# EAGLE design Layer 4 (EAGLE 9.6.2)

## Sheet 1 of 3: Light Sensor
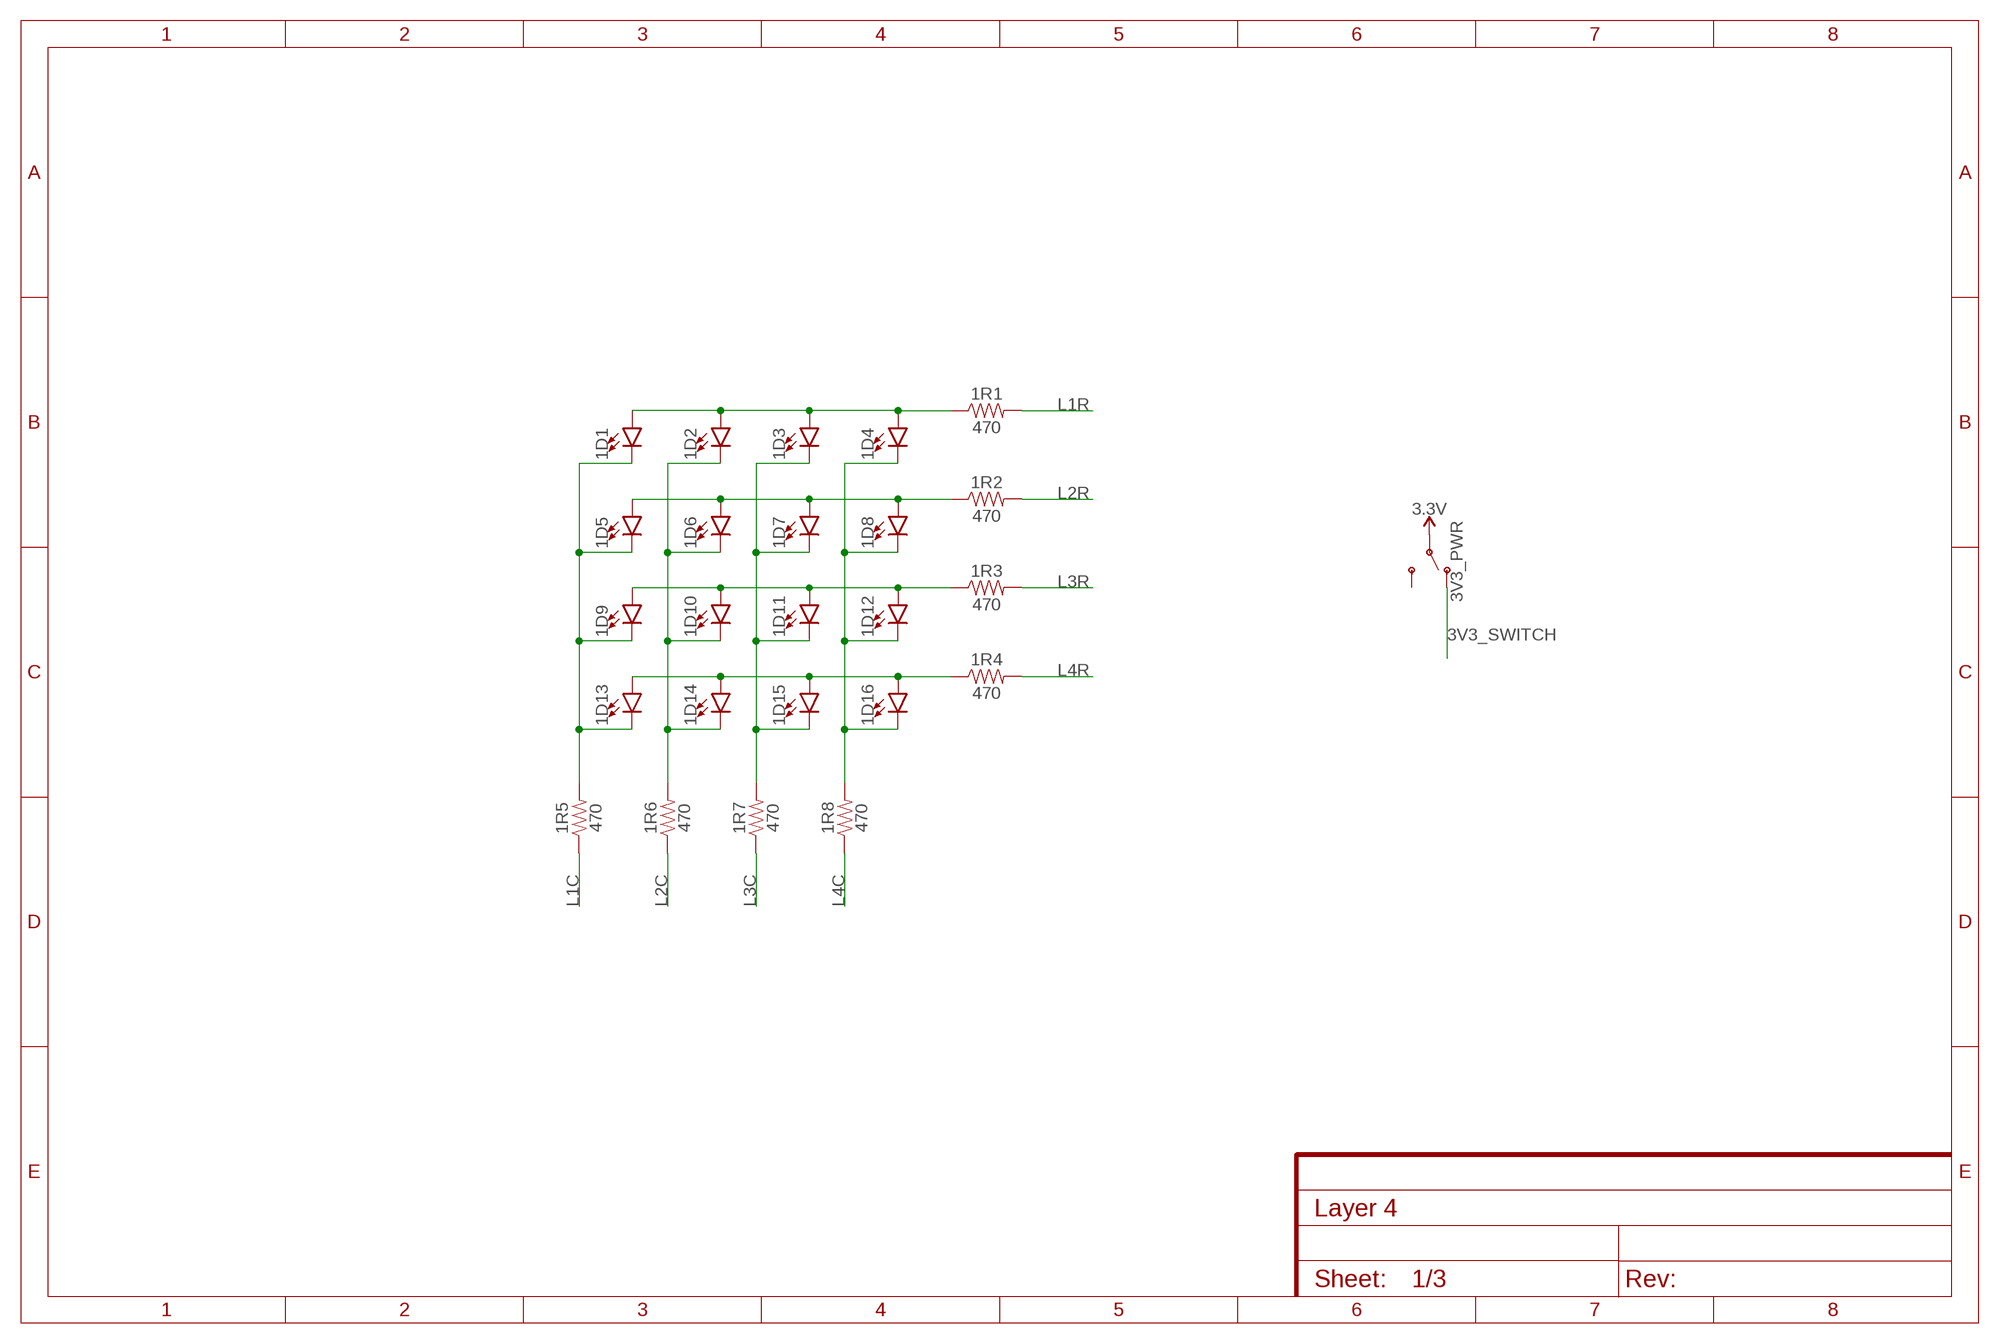
[diagram p0: schematic, sheet 1]

### Parts
1D1  LED0603  [LED-0603]
1D2  LED0603  [LED-0603]
1D3  LED0603  [LED-0603]
1D4  LED0603  [LED-0603]
1D5  LED0603  [LED-0603]
1D6  LED0603  [LED-0603]
1D7  LED0603  [LED-0603]
1D8  LED0603  [LED-0603]
1D9  LED0603  [LED-0603]
1D10  LED0603  [LED-0603]
1D11  LED0603  [LED-0603]
1D12  LED0603  [LED-0603]
1D13  LED0603  [LED-0603]
1D14  LED0603  [LED-0603]
1D15  LED0603  [LED-0603]
1D16  LED0603  [LED-0603]
1R1  470  RESISTOR0603  [R0603]
1R2  470  RESISTOR0603  [R0603]
1R3  470  RESISTOR0603  [R0603]
1R4  470  RESISTOR0603  [R0603]
1R5  470  RESISTOR0603  [R0603]
1R6  470  RESISTOR0603  [R0603]
1R7  470  RESISTOR0603  [R0603]
1R8  470  RESISTOR0603  [R0603]
3V3_PWR  SWITCH-SPDT-PTH-11.6X4.0MM-LOCK  [SWITCH_SPDT_PTH_11.6X4.0MM_LOCK]

### Nets
3.3V: 3V3_PWR.2(P) ; also sheet 2
3V3_SWITCH: 3V3_PWR.1(O) ; also sheet 2,3
L1C: 1R5.1 ; also sheet 2
L1R: 1R1.2 ; also sheet 2
L2C: 1R6.1 ; also sheet 2
L2R: 1R2.2 ; also sheet 2
L3C: 1R7.1 ; also sheet 2
L3R: 1R3.2 ; also sheet 2
L4C: 1R8.1 ; also sheet 2
L4R: 1R4.2 ; also sheet 2
N$9: 1D1.A 1D2.A 1D3.A 1D4.A 1R1.1
N$11: 1D1.C 1D5.C 1D9.C 1D13.C 1R5.2
N$19: 1D5.A 1D6.A 1D7.A 1D8.A 1R2.1
N$20: 1D9.A 1D10.A 1D11.A 1D12.A 1R3.1
N$21: 1D13.A 1D14.A 1D15.A 1D16.A 1R4.1
N$22: 1D2.C 1D6.C 1D10.C 1D14.C 1R6.2
N$23: 1D3.C 1D7.C 1D11.C 1D15.C 1R7.2
N$24: 1D4.C 1D8.C 1D12.C 1D16.C 1R8.2
Unconnected: 3V3_PWR.3(S)

## Sheet 2 of 3: STEM32
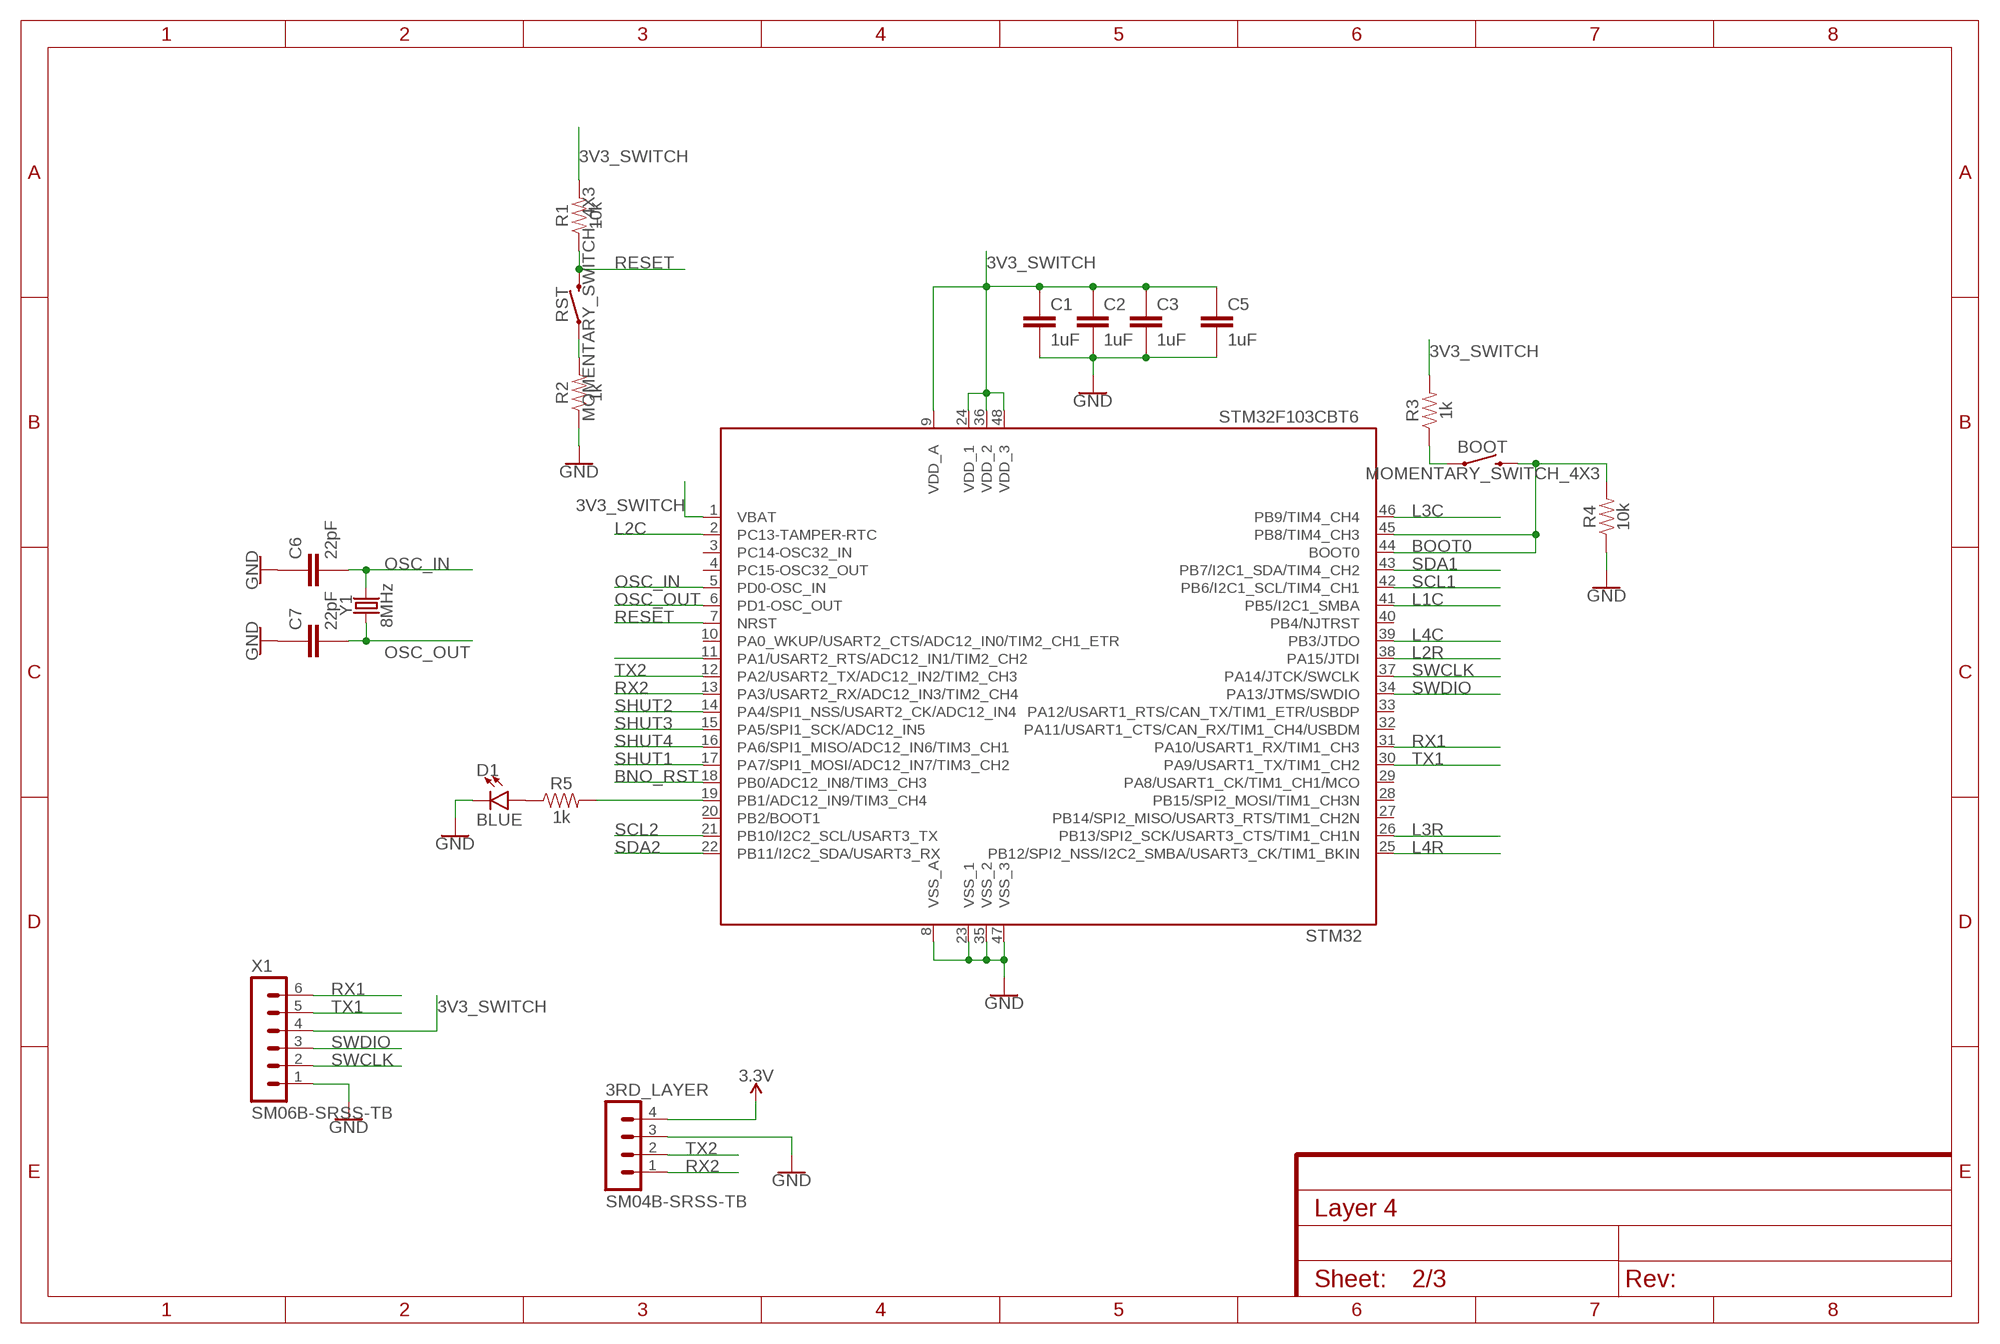
[diagram p1: schematic, sheet 2]

### Parts
3RD_LAYER  SM04B-SRSS-TB  [SM04B-SRSS-TB]
BOOT  MOMENTARY_SWITCH_4X3  [MOMENTARY_SWITCH_4X3]
C1  1uF  CAPACITOR0603  [C0603]
C2  1uF  CAPACITOR0603  [C0603]
C3  1uF  CAPACITOR0603  [C0603]
C5  1uF  CAPACITOR0603  [C0603]
C6  22pF  CAPACITOR0603  [C0603]
C7  22pF  CAPACITOR0603  [C0603]
D1  BLUE  LED0603  [LED-0603]
R1  10k  RESISTOR0603  [R0603]
R2  1k  RESISTOR0603  [R0603]
R3  1k  RESISTOR0603  [R0603]
R4  10k  RESISTOR0603  [R0603]
R5  1k  RESISTOR0603  [R0603]
RST  MOMENTARY_SWITCH_4X3  [MOMENTARY_SWITCH_4X3]
STM32  STM32F103CBT6  [LQFP48]
X1  SM06B-SRSS-TB  [SM06B-SRSS-TB]
Y1  8MHz  CRYSTALSMD-5X3.2-2PAD  [CRYSTAL-SMD-5X3.2-2PAD]

### Nets
3.3V: 3RD_LAYER.4 ; also sheet 1
3V3_SWITCH: C1.1 C2.1 C3.1 C5.2 R1.2 R3.2 STM32.1(VBAT) STM32.9(VDD_A) STM32.24(VDD_1) STM32.36(VDD_2) STM32.48(VDD_3) X1.4 ; also sheet 1,3
BNO_RST: STM32.18(PB0/ADC12_IN8/TIM3_CH3) ; also sheet 3
BOOT0: BOOT.P$2 R4.2 STM32.44(BOOT0) STM32.45(PB8/TIM4_CH3)
GND: 3RD_LAYER.3 C1.2 C2.2 C3.2 C5.1 C6.1 C7.1 D1.C R2.1 R4.1 STM32.8(VSS_A) STM32.23(VSS_1) STM32.35(VSS_2) STM32.47(VSS_3) X1.1 ; also sheet 3
L1C: STM32.41(PB5/I2C1_SMBA) ; also sheet 1
L1R: STM32.11(PA1/USART2_RTS/ADC12_IN1/TIM2_CH2) ; also sheet 1
L2C: STM32.2(PC13-TAMPER-RTC) ; also sheet 1
L2R: STM32.38(PA15/JTDI) ; also sheet 1
L3C: STM32.46(PB9/TIM4_CH4) ; also sheet 1
L3R: STM32.26(PB13/SPI2_SCK/USART3_CTS/TIM1_CH1N) ; also sheet 1
L4C: STM32.39(PB3/JTDO) ; also sheet 1
L4R: STM32.25(PB12/SPI2_NSS/I2C2_SMBA/USART3_CK/TIM1_BKIN) ; also sheet 1
N$70: R2.2 RST.P$1
N$72: BOOT.P$1 R3.1
N$73: R5.2 STM32.19(PB1/ADC12_IN9/TIM3_CH4)
N$74: D1.A R5.1
OSC_IN: C6.2 STM32.5(PD0-OSC_IN) Y1.P$2
OSC_OUT: C7.2 STM32.6(PD1-OSC_OUT) Y1.P$1
RESET: R1.1 RST.P$2 STM32.7(NRST)
RX1: STM32.31(PA10/USART1_RX/TIM1_CH3) X1.6
RX2: 3RD_LAYER.1 STM32.13(PA3/USART2_RX/ADC12_IN3/TIM2_CH4)
SCL1: STM32.42(PB6/I2C1_SCL/TIM4_CH1) ; also sheet 3
SCL2: STM32.21(PB10/I2C2_SCL/USART3_TX) ; also sheet 3
SDA1: STM32.43(PB7/I2C1_SDA/TIM4_CH2) ; also sheet 3
SDA2: STM32.22(PB11/I2C2_SDA/USART3_RX) ; also sheet 3
SHUT1: STM32.17(PA7/SPI1_MOSI/ADC12_IN7/TIM3_CH2) ; also sheet 3
SHUT2: STM32.14(PA4/SPI1_NSS/USART2_CK/ADC12_IN4) ; also sheet 3
SHUT3: STM32.15(PA5/SPI1_SCK/ADC12_IN5) ; also sheet 3
SHUT4: STM32.16(PA6/SPI1_MISO/ADC12_IN6/TIM3_CH1) ; also sheet 3
SWCLK: STM32.37(PA14/JTCK/SWCLK) X1.2
SWDIO: STM32.34(PA13/JTMS/SWDIO) X1.3
TX1: STM32.30(PA9/USART1_TX/TIM1_CH2) X1.5
TX2: 3RD_LAYER.2 STM32.12(PA2/USART2_TX/ADC12_IN2/TIM2_CH3)
Unconnected: STM32.3(PC14-OSC32_IN) STM32.4(PC15-OSC32_OUT) STM32.10(PA0_WKUP/USART2_CTS/ADC12_IN0/TIM2_CH1_ETR) STM32.20(PB2/BOOT1) STM32.27(PB14/SPI2_MISO/USART3_RTS/TIM1_CH2N) STM32.28(PB15/SPI2_MOSI/TIM1_CH3N) STM32.29(PA8/USART1_CK/TIM1_CH1/MCO) STM32.32(PA11/USART1_CTS/CAN_RX/TIM1_CH4/USBDM) STM32.33(PA12/USART1_RTS/CAN_TX/TIM1_ETR/USBDP) STM32.40(PB4/NJTRST)

## Sheet 3 of 3: Sensors
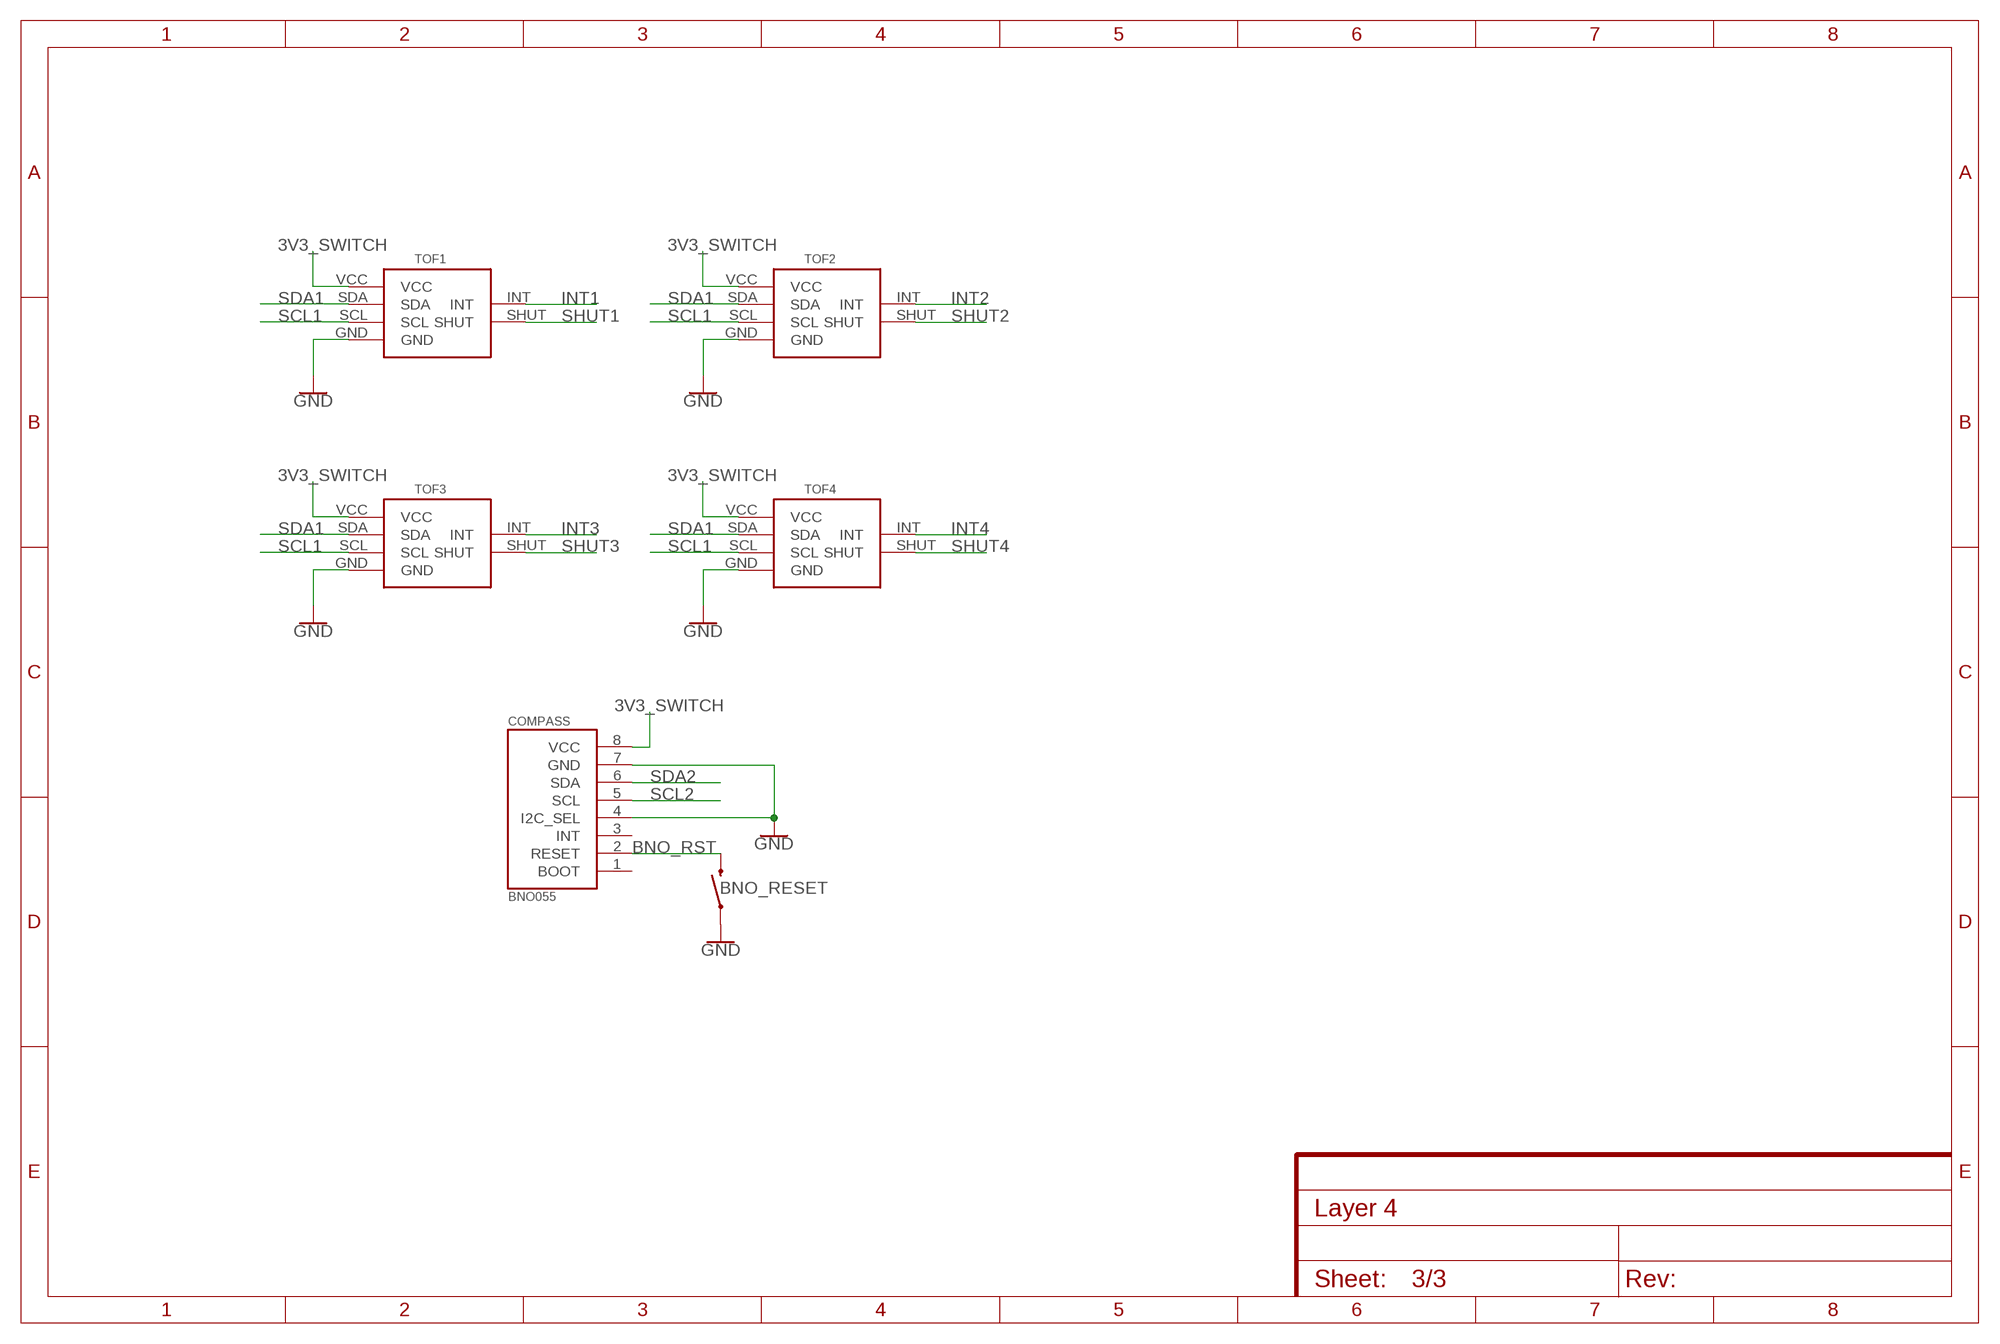
[diagram p2: schematic, sheet 3]

### Parts
BNO_RESET  MOMENTARY_SWITCH_4X3  [MOMENTARY_SWITCH_4X3]
COMPASS  BNO055  [BNO055]
TOF1  VL53L1X  [VL53L1X_SLANTEDPINS]
TOF2  VL53L1X  [VL53L1X_SLANTEDPINS]
TOF3  VL53L1X  [VL53L1X_SLANTEDPINS]
TOF4  VL53L1X  [VL53L1X_SLANTEDPINS]

### Nets
3V3_SWITCH: COMPASS.8(VCC) TOF1.VCC TOF2.VCC TOF3.VCC TOF4.VCC ; also sheet 1,2
BNO_RST: BNO_RESET.P$2 COMPASS.2(RESET) ; also sheet 2
GND: BNO_RESET.P$1 COMPASS.4(I2C_SEL) COMPASS.7(GND) TOF1.GND TOF2.GND TOF3.GND TOF4.GND ; also sheet 2
INT1: TOF1.INT
INT2: TOF2.INT
INT3: TOF3.INT
INT4: TOF4.INT
SCL1: TOF1.SCL TOF2.SCL TOF3.SCL TOF4.SCL ; also sheet 2
SCL2: COMPASS.5(SCL) ; also sheet 2
SDA1: TOF1.SDA TOF2.SDA TOF3.SDA TOF4.SDA ; also sheet 2
SDA2: COMPASS.6(SDA) ; also sheet 2
SHUT1: TOF1.SHUT ; also sheet 2
SHUT2: TOF2.SHUT ; also sheet 2
SHUT3: TOF3.SHUT ; also sheet 2
SHUT4: TOF4.SHUT ; also sheet 2
Unconnected: COMPASS.1(BOOT) COMPASS.3(INT)

## Library data of the parts
1D1-1D16 D1 = SparkFun-LED:LED: LED (Generic) Standard schematic elements and footprints for 5mm, 3mm, 1206, and 0603 sized LEDs. Generic LEDs with no color specified.
1R1-1R8 R1-R5 = JH:RESISTOR
3RD_LAYER = con-JST SH:SM04B-SRSS: JST SH series header 1.00mm pitch disconnectable crimp style connectors, horizontal (side entry type), 4 pins
3V3_PWR = SparkFun-Switches:SWITCH-SPDT: Single Pole, Double Throw (SPDT) Switch Single-pole, double-throw (SPDT) switch. Variant Overview SMD-AYZ0202 Surface Mount DPDT Switch <https://www.sparkfun.com/products/597> (COM-00597) Used on e.g. LilyPad Arduino USB - ATmega32U4 Board <https://www.sparkfun.com/products/12049> PTH-11.6X4.0MM SPDT Mini Power Switch <https://www.sparkfun.com/products/102> (COM-00102) Used on e.g. SparkFun Simon Says - Through-Hole Soldering Kit <https://www.sparkfun.com/products/10547> (KIT-10547) PTH-11.6X4.0MM-KIT KIT version of SPDT Mini Power Switch - Simplifies soldering by removing tStop of switch pins - only one side can be soldered. PTH-11.6X4.0MM-LOCK LOCK version of SPDT Mini Power Switch - Offset pins hold switch in place for easier soldering. SMD-RIGHT-ANGLE Surface Mount Right Angle Switch <https://www.sparkfun.com/products/10860> (COM-10860) Used on e.g. SparkFun ESP8266 Thing <https://www.sparkfun.com/products/13231>; PROD_ID: SWCH-08261; SF_SKU: COM-00102
BNO_RESET BOOT RST = MY-LIBRARY:MOMENTARY_SWITCH_4X3
C1-C3 C5-C7 = JH:CAPACITOR
COMPASS = JH:BNO055
STM32 = JH:STM32F103CBT6
TOF1-TOF4 = JH:VL53L1X
X1 = con-JST SH:SM06B-SRSS: JST SH series header 1.00mm pitch disconnectable crimp style connectors, horizontal (side entry type), 6 pins
Y1 = SparkFun-Clocks:CRYSTAL: Crystals (Generic) These are passive quartz crystals, which can be used as a clock source for a microcontroller. Crystal's are two-terminal devices. They require external "load" capacitors to generate an oscillating signal.

## Board
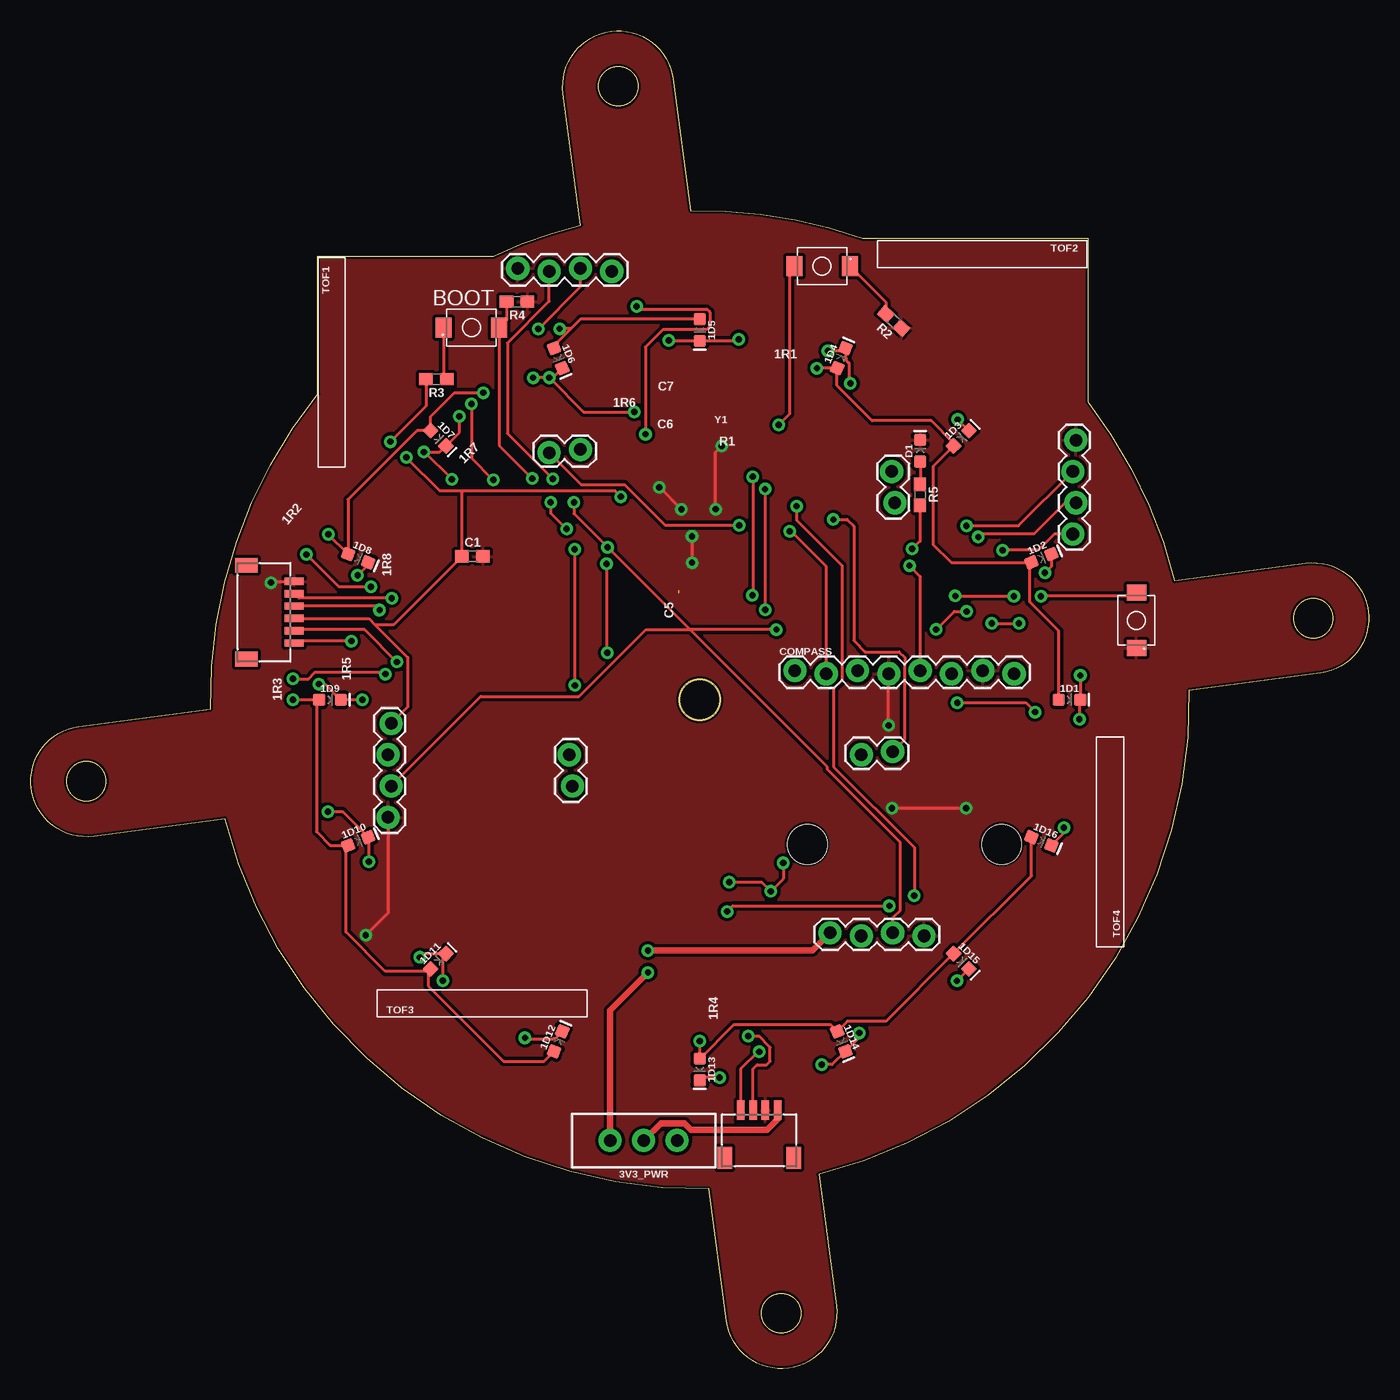
[diagram p3: board, top side]
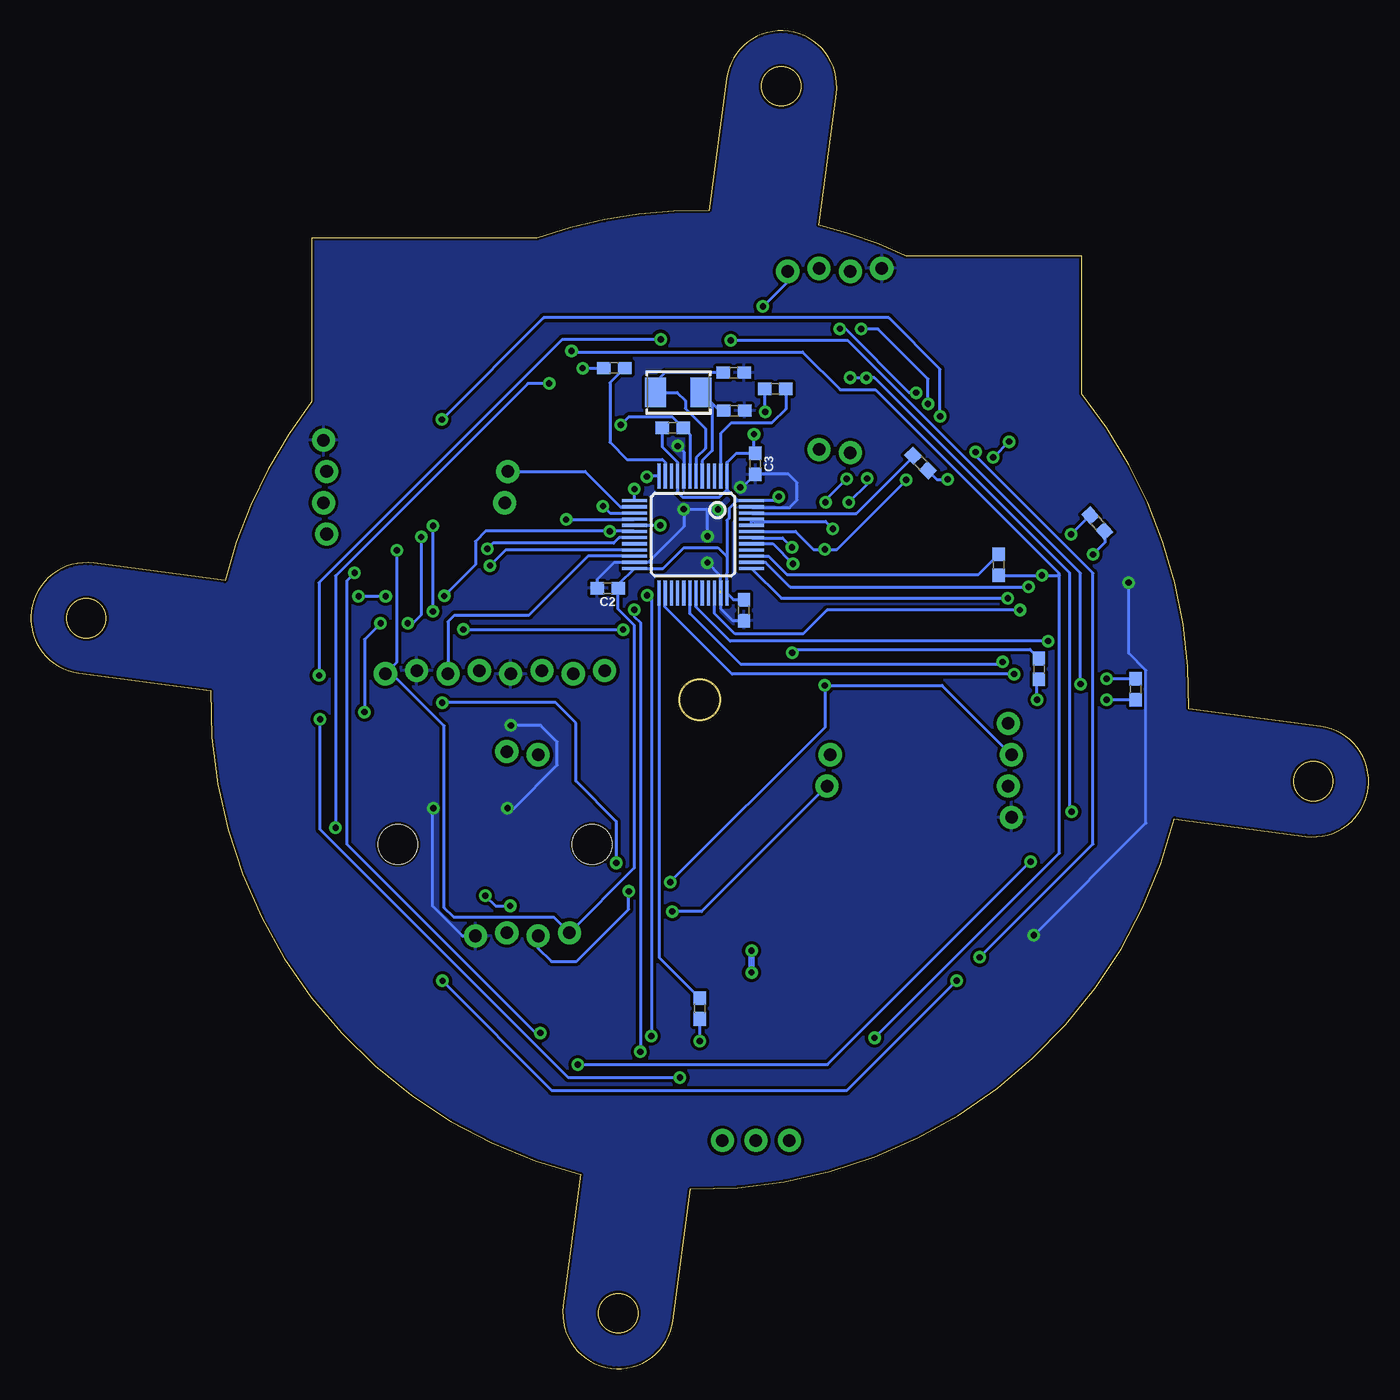
[diagram p4: board, bottom side, seen from below]

Size 108.54 x 108.54 mm. Coordinates in mm from the lower left corner, seen from the top.
Outline: 5.09,43.19 arc-180 3.9,52.11 14.57,53.53 arc-40 23.27,79.08 23.27,90.27 37.52,90.27 arc-11 44.61,92.78 43.19,103.45 arc-180 52.11,104.63 53.53,93.97 arc-20 67.45,91.72 85.76,91.72 85.76,78.45 arc-23 92.78,63.93 103.45,65.35 arc-180 104.63,56.43 93.97,55.01 arc-77 63.93,15.76 65.35,5.09 arc-180 56.43,3.9 55.01,14.57 arc-77 15.76,44.61 5.09,43.19
Outline: circle at 54.27,54.27 radius 1.6
Outline: circle at 104.04,60.89 radius 1.6
Outline: circle at 60.89,4.5 radius 1.6
Outline: circle at 4.5,47.65 radius 1.6
Outline: circle at 47.65,104.04 radius 1.6
Outline: circle at 54.27,54.27 radius 1.7
Copper layers (1*16): Top 0.035mm / dielectric 1.5mm / Bottom 0.035mm
Design rules "SparkFun-2-layer-STANDARD": minimum track width 10mil, minimum drill 20mil, track to track 10mil, track to pad 8mil, pad to pad 8mil, via to via 10mil, smd to smd 8mil, copper to edge 8mil, drill to drill 8mil, minimum pad ring 10mil, minimum via ring 10mil, stop-mask expansion 4mil, vias tented up to drill 25mil, thermal gap 10mil

### Footprints (pad centres in the part's own frame; a part is rotated, then mirrored left to right if it is on the bottom)
LED-0603 = smd 1 x 1: A -0.877,0; C 0.877,0
R0603 = smd 1.1 x 1: 1 -0.85,0; 2 0.85,0
SM04B-SRSS-TB = smd 0.6 x 1.55: 1 1.5,0; 2 0.5,0; 3 -0.5,0; 4 -1.5,0 | smd 1.2 x 1.8: M1 2.8,3.875; M2 -2.8,3.875
SWITCH_SPDT_PTH_11.6X4.0MM_LOCK = drill 1.016 pad 1.88: 1 0,2.718; 2 0,0; 3 0,-2.718
MOMENTARY_SWITCH_4X3 = smd 1.3 x 1.6: P$1 -2.25,0; P$2 2.25,0
C0603 = smd 1.1 x 1: 1 -0.85,0; 2 0.85,0
BNO055 = drill 1.016 pad 1.88: 1 -8.89,14.097; 2 -6.35,13.843; 3 -3.81,14.097; 4 -1.27,13.843; 5 1.27,14.097; 6 3.81,13.843; 7 6.35,14.097; 8 8.89,13.843 | hole 3.2: -7.874,0; 7.874,0
LQFP48 = smd 0.254 x 2.032: 1 -2.75,-4.758; 2 -2.25,-4.758; 3 -1.75,-4.758; 4 -1.25,-4.758; 5 -0.75,-4.758; 6 -0.25,-4.758; 7 0.25,-4.758; 8 0.75,-4.758; 9 1.25,-4.758; 10 1.75,-4.758; 11 2.25,-4.758; 12 2.75,-4.758; 25 2.75,4.758; 26 2.25,4.758; 27 1.75,4.758; 28 1.25,4.758; 29 0.75,4.758; 30 0.25,4.758; 31 -0.25,4.758; 32 -0.75,4.758; 33 -1.25,4.758; 34 -1.75,4.758; 35 -2.25,4.758; 36 -2.75,4.758 | smd 2.032 x 0.254: 13 4.758,-2.75; 14 4.758,-2.25; 15 4.758,-1.75; 16 4.758,-1.25; 17 4.758,-0.75; 18 4.758,-0.25; 19 4.758,0.25; 20 4.758,0.75; 21 4.758,1.25; 22 4.758,1.75; 23 4.758,2.25; 24 4.758,2.75; 37 -4.758,2.75; 38 -4.758,2.25; 39 -4.758,1.75; 40 -4.758,1.25; 41 -4.758,0.75; 42 -4.758,0.25; 43 -4.758,-0.25; 44 -4.758,-0.75; 45 -4.758,-1.25; 46 -4.758,-1.75; 47 -4.758,-2.25; 48 -4.758,-2.75
VL53L1X_SLANTEDPINS = drill 1.016 pad 1.88: GND -7.627,2; INT 7.073,7.08; SCL -7.373,4.54; SDA -7.627,7.08; SHUT 7.327,4.54; VCC -7.373,9.62
SM06B-SRSS-TB = smd 0.6 x 1.55: 1 2.5,0; 2 1.5,0; 3 0.5,0; 4 -0.5,0; 5 -1.5,0; 6 -2.5,0 | smd 1.2 x 1.8: M1 3.8,3.875; M2 -3.8,3.875
CRYSTAL-SMD-5X3.2-2PAD = smd 1.7 x 2.4: P$1 1.85,0; P$2 -1.85,0

### Placement (x,y rotation side)
1D1  84.27,54.27 0 top
1D2  81.99,65.75 22.5 top
1D3  75.48,75.48 45 top
1D4  65.75,81.99 67.5 top
1D5  54.27,84.27 270 top
1D6  42.79,81.99 292.5 top
1D7  33.06,75.48 315 top
1D8  26.55,65.75 337.5 top
1D9  24.27,54.27 0 top
1D10  26.55,42.79 22.5 top
1D11  33.06,33.06 45 top
1D12  42.79,26.55 67.5 top
1D13  54.27,24.27 270 top
1D14  65.75,26.55 292.5 top
1D15  75.48,33.06 315 top
1D16  81.99,42.79 337.5 top
1R1  61.22,81.18 0 bottom
1R2  22.01,68.59 311.5 bottom
1R3  18.91,55.12 90 bottom
1R4  54.28,29.23 90 bottom
1R5  26.75,56.77 270 bottom
1R6  48.15,79.48 180 bottom
1R7  36.35,73.48 315 bottom
1R8  30.02,65.22 270 bottom
3RD_LAYER  59.09,20.98 180 top
3V3_PWR  49.72,18.52 90 top
BNO_RESET  89.71,60.71 90 top
BOOT  35.74,84.47 0 top
C1  35.83,65.9 0 top
C2  61.75,63.32 180 bottom
C3  49.76,73.41 270 bottom
C5  50.68,61.54 90 bottom
C6  51.47,77.73 180 bottom
C7  51.52,80.8 180 bottom
COMPASS  70.88,42.53 0 top
D1  72.15,74.47 90 top
R1  56.47,76.34 180 bottom
R2  70,84.99 137.5 top
R3  32.91,80.28 180 top
R4  39.45,86.57 180 top
R5  72.13,70.91 270 top
RST  64.2,89.45 180 top
STM32  54.82,67.67 180 bottom
TOF1  37.51,81.64 270 top
TOF2  77.17,77.33 180 top
TOF3  36.61,42.73 0 top
TOF4  74.46,42.74 90 top
X1  21.37,61.37 90 top
Y1  56,79.2 180 bottom

### Tracks (layer width: path | path; a pad name or v marks a point on that pad's centre or on a via)
3.3V
  Top 0.508: 3RD_LAYER.4 60.6,20.97 60.6,20.26 59.71,19.37 53.56,19.37 53.02,19.92 51.12,19.92 3V3_PWR.2
3V3_SWITCH  (via drill 0.51)
  Top 0.254: v30.46,73.93 33.2,71.2 34.97,71.2 | v47.86,70.75 47.4,71.2 34.97,71.2 | v49.15,86.18 49.35,85.98 54.82,85.98 55.1,85.7 55.1,84.6 54.82,84.32 51.3,84.32 49.87,82.88 v49.87,75.82 | TOF2.VCC 83.03,67.71 81.73,66.42 78.87,66.42 v78.85,66.39 | 27.94,60.34 27.44,60.85 21.39,60.85 X1.4 | 27.94,60.34 30.58,57.71 30.58,53.69 TOF3.VCC | 27.94,60.34 29.42,60.34 C1.1 34.98,71.19 34.97,71.2 | R3.2 32.06,78.1 v29.17,75.21
  Top 0.508: 3V3_PWR.1 47,29.07 v50.07,32.14 | v50.07,33.92 63.4,33.92 TOF4.VCC
  Bottom 0.254: STM32.48 51.17,70.42 52.07,71.32 | 52.07,71.32 STM32.1 52.07,73.51 51.33,74.26 C3.1 49.87,74.37 v49.87,75.82 | STM32.48 48.19,70.42 v47.86,70.75 | TOF1.VCC 47.13,88.2 v49.15,86.18 | STM32.9 56.08,72.42 | 56.08,72.42 56.08,71.12 55.68,70.72 52.67,70.72 52.11,71.27 52.11,71.28 52.07,71.32 | v78.85,66.39 78.85,66.39 78.85,57.29 COMPASS.8 79.22,56.38 75,52.15 75,37.4 74.24,36.64 66.12,36.64 TOF4.VCC 59.6,40.6 59.6,60.33 60.9,61.63 C2.1 60.9,63.6 STM32.24 59.56,64.91 57.27,64.91 55.57,66.61 52.81,66.61 52.07,65.87 | R1.2 57.32,74.79 56.08,73.55 56.08,72.42 | STM32.48 51.26,70.42 51.89,69.78 51.89,69.01 52.07,68.83 52.07,65.87 | 52.07,65.87 52.07,64.53 52.06,64.53 52.07,64.52 STM32.36 51.55,62.39 C5.2 | v29.17,75.21 30.45,73.93 v30.46,73.93
  Bottom 0.508: v50.07,32.14 v50.07,33.92
BNO_RST  (via drill 0.51)
  Top 0.254: BNO_RESET.P$2 89.41,62.67 v81.95,62.67 | v75,62.69 79.73,62.69 v79.75,62.67 | COMPASS.2 64.53,65.09 61.68,67.94 v61.57,67.94
  Bottom 0.254: v75,62.69 72.47,65.22 72.47,67.12 71.65,67.94 v61.57,67.94 59.6,67.94 STM32.18 | v81.95,62.67 v81.94,62.67 v79.75,62.67
BOOT0  (via drill 0.51)
  Top 0.254: v40.68,72.22 37.99,74.9 BOOT.P$2 38.6,85.07 R4.2 | v42.17,70.29 42.17,69.41 43.44,68.14 v43.46,68.14
  Bottom 0.254: STM32.44 STM32.45 49.87,68.73 44.06,68.73 v43.46,68.14 | v40.68,72.22 40.68,71.79 v42.17,70.29
GND  (via drill 0.51)  (1 unrouted)
  Top 0.254: v69.6,52.19 69.6,56.36 COMPASS.4 | TOF3.GND 28.98,36.98 v27.17,35.17 | v19.47,63.77 19.57,63.87 X1.1 | v50.98,71.51 v50.99,71.51 v52.78,69.72 | v55.56,69.74 55.56,74.35 v56.06,74.85 | v53.64,67.52 v53.65,67.51 v53.65,65.39 | v75.89,45.47 v69.87,45.47
  Bottom 0.254: 50.1,69.88 STM32.47 50,69.85 46.99,69.85 46.37,70.47 46.37,71.87 47.06,72.56 C3.2 50.8,71.51 v50.98,71.51 | v69.87,45.47 69.33,45.47 65.83,48.97 65.83,50.85 67.16,52.19 v69.6,52.19 | v19.47,63.77 19.47,58.05 18.08,56.65 18.08,44.26 v27.17,35.17 | v52.78,69.72 v52.79,69.72 53.67,69.72 | 53.67,69.72 55.54,69.72 v55.56,69.74 v55.56,69.73 55.56,68.33 58.47,65.42 STM32.23 61.21,65.42 62.6,64.04 C2.2 | v56.06,74.85 v56.05,74.85 55.56,74.37 STM32.8 | 52.57,63.14 52.57,63.13 | C5.1 51.6,60.69 52.57,61.66 STM32.35 52.57,64.32 v53.65,65.39 | 53.67,69.72 53.64,69.69 v53.64,67.52 | v69.6,52.19 | TOF4.GND 73.51,35.11 75.95,37.54 75.95,45.41 v75.89,45.47
  pour Top: -3.63,110.27 -3.63,-5.03 15.17,-5.03 144.47,-5.03 144.47,38.97 144.47,110.27
  pour Bottom: -14.73,-6.23 129.07,-6.23 129.07,110.17 -14.73,110.17
L1C  (via drill 0.51)
  Top 0.254: v46.71,65.3 46.69,65.28 46.69,58.15 v46.76,58.08
  Bottom 0.254: 1R5.1 27.48,58.35 46.5,58.35 v46.76,58.08 | STM32.41 48.34,66.92 v46.71,65.3
L1R
  Bottom 0.254: 1R1.2 61.56,79.98 61.56,75.16 60.18,73.77 57.31,73.77 57.06,73.52 57.06,72.44 STM32.11
L2C
  Bottom 0.254: 1R6.1 47.29,77.86 48.43,76.72 51.73,76.72 52.57,75.88 STM32.2
L2R  (via drill 0.51)
  Top 0.254: v27.59,63.43 25,63.43 v22.37,66.06
  Bottom 0.254: v22.37,66.06 21.41,67.01 21.41,67.92 1R2.2 | v27.59,63.43 46.93,63.43 48.92,65.41 STM32.38 | v27.59,63.43
L3C
  Bottom 0.254: 1R7.1 36.95,74.01 41.57,69.39 50.04,69.39 STM32.46
L3R  (via drill 0.51)
  Top 0.254: v21.27,55.97 22.52,55.97 23.01,56.46 28.67,56.46 28.77,56.37 v28.77,56.35
  Bottom 0.254: 1R3.2 v21.27,55.97 | v28.77,56.35 51.64,56.35 57.07,61.78 STM32.26
L4C
  Bottom 0.254: 1R8.1 31.69,64.4 47.16,64.4 48.68,65.92 STM32.39
L4R
  Bottom 0.254: STM32.25 57.57,33.37 1R4.2
N$9  (via drill 0.51)
  Top 0.254: 1D1.A 83.39,59.86 81.02,62.23 81.02,65.26 1D2.A 74.67,65.41 73.21,66.88 73.21,73.21 1D3.A 74.86,75.1 73.06,76.9 68.24,76.9 65.41,79.73 1D4.A v63.78,81.18 v63.77,81.17
  Bottom 0.254: v63.77,81.17 1R1.1
N$11  (via drill 0.51)
  Top 0.254: v85.15,56.24 1D1.C 85.07,54.19 v85.07,52.68 | v55.88,23.62 54.5,23.62 1D13.C | v23.38,55.54 23.88,55.54 1D9.C v26.9,54.26 | v51.76,83.42 54.24,83.42 1D5.C 57.32,83.39 v57.44,83.52
  Bottom 0.254: v23.38,55.54 23.38,64.54 42.26,83.42 v51.76,83.42 | v85.15,56.24 85.15,63.77 65.41,83.52 v57.44,83.52 | v55.88,23.62 64.93,23.62 85.07,43.76 v85.07,52.68 | v26.9,54.26 26.9,55.76 1R5.2
N$19  (via drill 0.51)
  Top 0.254: 1D6.A 42.24,82.8 43.81,84.37 | v24.14,67.7 24.14,67.69 1D8.A 25.74,70.52 31.32,76.1 1D7.A 32.44,77.25 34.37,79.18 v36.71,79.18 | 43.81,84.37 v42.9,84.37 | 43.81,84.37 44.59,85.15 1D5.A
  Bottom 0.254: v36.71,79.18 37.28,79.18 42.47,84.37 v42.9,84.37 | 1R2.1 22.6,69.22 v24.13,67.7 v24.14,67.7
N$20  (via drill 0.51)
  Top 0.254: 25.57,42.45 24.29,42.45 23.18,43.57 23.18,54.06 1D9.A v21.27,54.27 | 25.57,42.45 1D10.A | 32.24,32.24 1D11.A 32.24,32.24 | 32.24,32.24 32.24,31.06 38.37,24.93 41.64,24.93 1D12.A | 32.24,32.24 28.76,32.24 25.57,35.43 25.57,42.45
  Bottom 0.254: 1R3.1 v21.27,54.27
N$21  (via drill 0.51)
  Top 0.254: 1D16.A 81.18,39.99 1D15.A 69.38,28.19 66.24,28.19 1D14.A 64.9,27.87 57,27.87 1D13.A v54.27,26.57
  Bottom 0.254: v54.27,26.57 54.27,28.37 1R4.1
N$22  (via drill 0.51)
  Top 0.254: v64.17,24.67 65.01,24.67 1D14.C 67.21,26.87 v67.21,27.24 | 1D2.C 82.8,65.08 v82.27,64.56 | v24.09,45.19 25.3,45.19 1D10.C 27.43,43.06 v27.43,41.13 | 1D6.C 42.35,80.4 v40.75,80.4 | v48.96,77.62 44.85,77.62 v42.07,80.4
  Bottom 0.254: v24.09,45.19 24.28,45.38 24.28,64.58 40.1,80.4 v40.75,80.4 v40.76,80.4 v42.07,80.4 | v64.17,24.67 43.9,24.67 v27.43,41.13 | v82.27,64.56 82.92,63.92 82.92,42.55 67.6,27.24 v67.21,27.24 | v48.96,77.62 48.96,79.45 1R6.2
N$23  (via drill 0.51)
  Top 0.254: v75.14,31.47 1D15.C | v75.18,77 76.09,76.1 1D3.C | v34.77,77.27 34.77,75.96 1D7.C 33.18,74.37 v31.88,74.37 31.95,74.37 v34.16,72.16 | v31.57,33.37 31.88,33.68 1D11.C 33.41,33.41 v33.41,31.5 v33.42,31.49
  Bottom 0.254: v31.57,33.37 22.38,42.56 22.38,64.54 31.88,74.05 v31.88,74.37 | v75.14,31.47 75.14,31.45 66.24,22.55 42.36,22.55 v33.42,31.49 | v75.18,77 66.93,85.26 38.94,85.26 34.77,81.09 v34.77,77.27 | 1R7.2 35.75,72.84 35.73,72.84 35.03,72.14 34.18,72.14 v34.16,72.16
N$24  (via drill 0.51)
  Top 0.254: v83.82,43.89 83.82,43.47 1D16.C | v64.67,82.57 65.86,82.57 1D4.C 66.09,81.89 66.39,81.58 66.39,80.03 v66.49,79.93 | v26.51,64.36 27.36,65.22 1D8.C | v40.09,26.84 40.21,26.72 42.48,26.72 1D12.C
  Bottom 0.254: v83.82,43.89 83.82,64.32 68.2,79.93 v66.49,79.93 | v64.67,82.57 64.59,82.49 45.92,82.49 42.86,79.43 40.03,79.43 25.14,64.54 25.14,64.36 | v40.09,26.84 25.09,41.84 25.09,64.36 25.14,64.36 | 25.14,64.36 v26.51,64.36 1R8.2
N$70
  Top 0.254: RST.P$1 69.37,86.53 R2.2
N$72
  Top 0.254: R3.1 33.87,80.28 33.49,80.66 BOOT.P$1
N$73  (via drill 0.51)
  Top 0.254: R5.2 72.14,67.14 v71.51,66.51
  Bottom 0.254: STM32.19 60.82,67.42 61.26,66.97 71.05,66.97 v71.51,66.51
N$74
  Top 0.254: D1.A 72.15,71.78 R5.1
OSC_IN
  Bottom 0.254: C6.2 52.68,77.73 Y1.P$2 53.27,78.32 53.27,74.47 54.07,73.67 STM32.5
OSC_OUT
  Bottom 0.254: C7.2 57.1,80.8 57.85,80.06 Y1.P$1 56.1,79.2 55.44,78.54 55.44,77.9 53.82,76.28 53.82,74.66 54.56,73.91 STM32.6
RESET  (via drill 0.51)
  Top 0.254: RST.P$2 61.56,89.06 61.56,77.46 v60.67,76.57
  Bottom 0.254: STM32.7 55.07,75.79 R1.1 | R1.1 | R1.1 56.51,77.23 60.01,77.23 v60.67,76.57
RX1  (via drill 0.51)
  Top 0.254: X1.6 21.53,59.03 v26.01,59.03
  Bottom 0.254: STM32.31 54.57,61.8 51.8,59.03 v26.01,59.03
RX2  (via drill 0.51)
  Top 0.254: v59.57,71.37 59.57,61.59 v59.59,61.57 | v59.09,25.71 58.99,25.71 57.59,24.31 3RD_LAYER.1
  Bottom 0.254: STM32.13 v59.58,71.36 v59.57,71.37 | v59.59,61.57 59.59,61.03 59.09,60.54 v59.09,25.71
SCL1  (via drill 0.51)
  Top 0.254: v75.91,68.38 80.13,68.38 TOF2.SCL | v42.34,72.2 38.67,75.87 38.67,83.22 42.05,86.59 TOF1.SCL | v44.07,70.29 44.07,69.36 v46.78,66.65 v46.79,66.65 53.47,59.96 | v73.45,59.97 74.92,61.43 v75.93,61.43 | 53.47,59.96 64.62,48.81 64.62,48.62 70.54,42.71 70.54,37.18 69.92,36.55 TOF4.SCL | v60.49,59.96 53.47,59.96 | TOF3.SCL 36.51,54.54 44.5,54.54 49.92,59.96 53.47,59.96
  Bottom 0.254: STM32.42 50.05,67.41 47.55,67.41 v46.79,66.65 | v75.91,68.38 75.93,68.37 v75.93,61.43 | v73.44,59.96 v73.45,59.97 v60.5,59.97 v60.49,59.96 | v42.34,72.2 44.07,70.47 v44.07,70.29
SCL2  (via drill 0.51)
  Top 0.254: v71.28,65.15 72.15,64.28 COMPASS.5
  Bottom 0.254: STM32.21 70.01,66.42 v71.28,65.15
SDA1  (via drill 0.51)
  Top 0.254: v76.87,67.47 77.12,67.72 81.38,67.72 83.91,70.25 TOF2.SDA | v37.52,72.11 35.76,73.86 v35.76,78.27 v35.76,78.28 | v41.17,84.35 44.59,87.77 TOF1.SDA | v61.04,41.03 61.04,39.73 v60.04,38.73 59.29,39.47 v56.67,39.47 | v44.12,66.47 v44.13,66.47 v44.13,55.43 | v77.97,60.47 v80.17,60.47 | v75.17,54.03 80.71,54.03 v81.47,53.27
  Bottom 0.254: v76.87,67.47 76.89,67.44 76.89,61.13 77.55,60.47 v77.97,60.47 | STM32.43 46.49,67.92 45.05,66.47 v44.12,66.47 43.15,66.47 v37.52,72.11 | v35.76,78.28 35.76,80.3 39.81,84.35 v41.17,84.35 | v61.04,41.03 61.04,44.4 64.32,47.67 64.32,52.38 65.96,54.03 v75.17,54.03 | v56.67,39.47 44.13,52.01 v44.13,55.43 34.6,55.43 TOF3.SDA | v60.04,38.73 60.04,37.27 64.27,33.03 66.3,33.03 67.38,34.11 TOF4.SDA | v80.17,60.47 81.47,59.17 v81.47,53.27
SDA2
  Bottom 0.254: STM32.22 63.34,65.92 68.12,61.14 74.15,61.14 74.69,60.6 COMPASS.6
SHUT1  (via drill 0.51)
  Top 0.254: TOF1.SHUT 44.65,71.71 48.17,71.71 51.45,68.43 v57.48,68.43
  Bottom 0.254: v57.48,68.43 57.49,68.42 STM32.17
SHUT2
  Bottom 0.254: STM32.14 60.69,69.92 63.56,72.79 TOF2.SHUT
SHUT3  (via drill 0.51)
  Top 0.254: v56.49,37.1 56.94,37.54 v69.65,37.54 | v62.12,69.98 62.12,68.84 65.8,65.16 65.8,55.85 65.13,55.18 65.13,48.83 71.7,42.27 71.7,38.4 v71.67,38.37
  Bottom 0.254: TOF3.SHUT 54.11,37.1 v56.49,37.1 | v62.12,69.98 61.57,69.42 STM32.15 | v71.67,38.37 70.84,37.54 v69.65,37.54
SHUT4  (via drill 0.51)
  Top 0.254: TOF4.SHUT 70.88,51.02 70.88,57.16 70.9,57.18 70.9,57.7 70.45,58.15 67.69,58.15 66.76,59.07 66.76,68.35 66.22,68.89 v65.11,68.89
  Bottom 0.254: v65.11,68.89 59.6,68.89 STM32.16
SWCLK  (via drill 0.51)
  Top 0.254: v29.28,62.5 29.27,62.51 21.73,62.51 X1.2
  Bottom 0.254: STM32.37 47.66,62.51 v29.28,62.51 v29.28,62.5
SWDIO  (via drill 0.51)
  Top 0.254: X1.3 27.98,61.86 v28.29,61.55
  Bottom 0.254: STM32.34 53.07,61.26 51.41,59.6 45.89,59.6 43.94,61.55 v28.29,61.55
TX1  (via drill 0.51)
  Top 0.254: X1.5 21.45,59.95 27.08,59.95 v29.69,57.34
  Bottom 0.254: v29.69,57.34 29.86,57.17 50.98,57.17 55.07,61.26 STM32.30
TX2  (via drill 0.51)
  Top 0.254: v58.57,72.37 58.57,62.78 v58.55,62.75 | 3RD_LAYER.2 58.59,24.34 58.91,24.66 59.69,24.66 59.98,24.95 59.98,26.07 59.07,26.98 v58.2,26.98
  Bottom 0.254: v58.57,72.37 58.51,72.43 STM32.12 | v58.55,62.75 58.2,62.41 v58.2,26.98 | v58.2,26.98